# Altium schematic sheet CPU.SchDoc
size A4
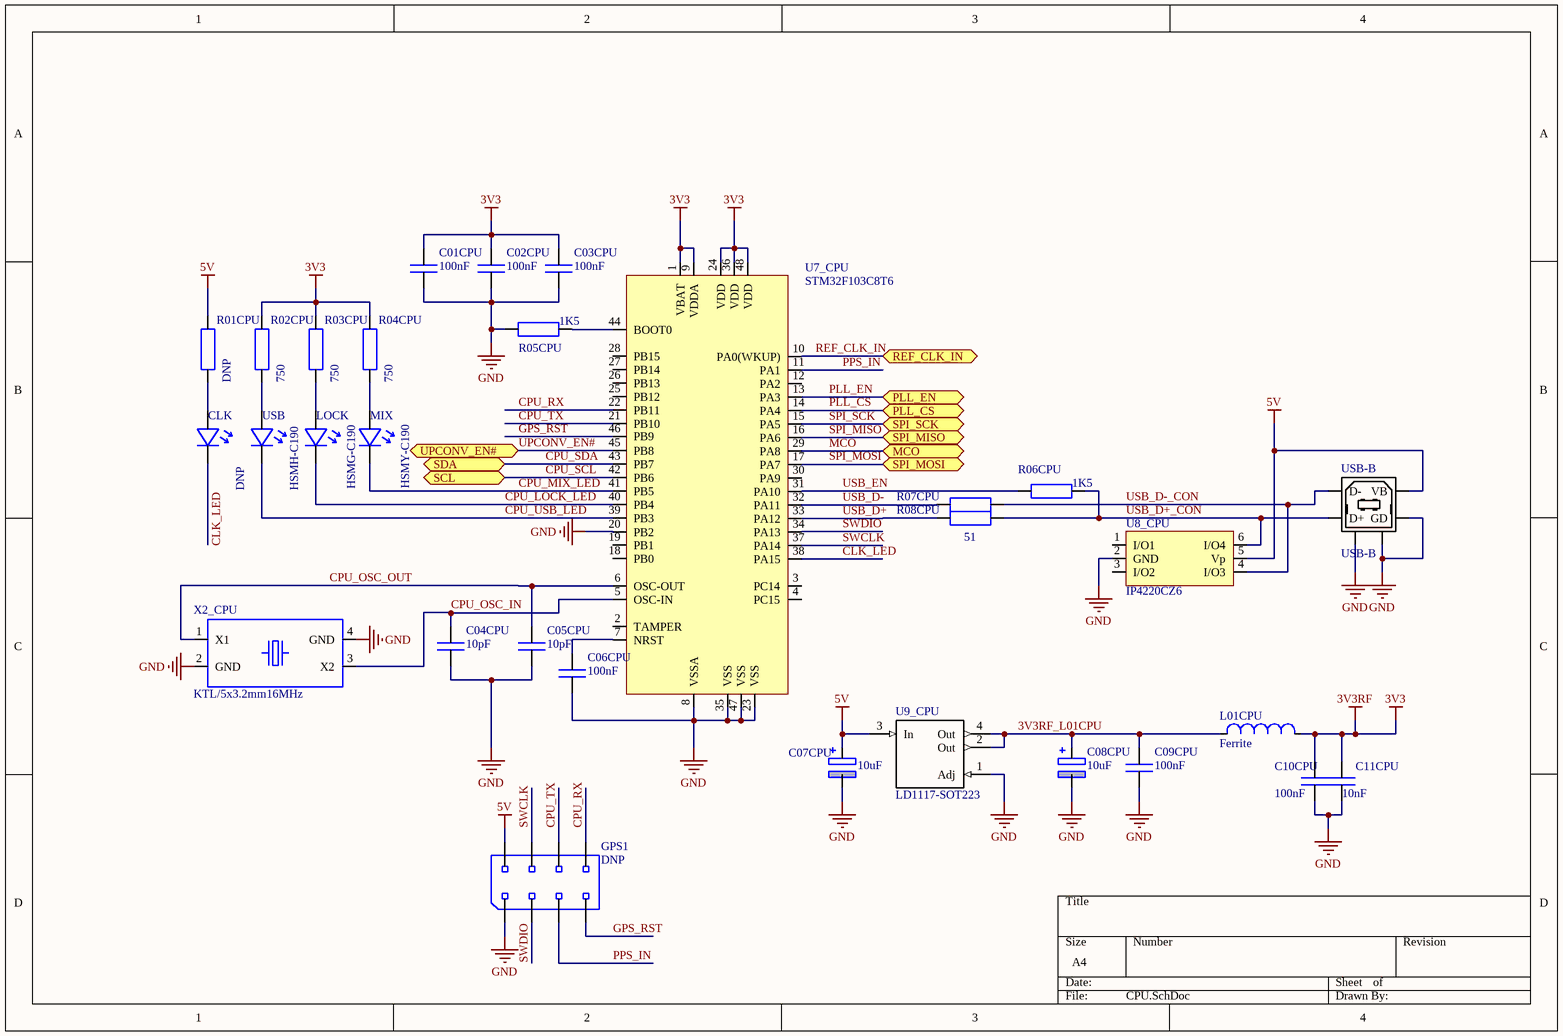
[diagram p0: CPU.SchDoc]

## Parts
C01CPU  100nF  [smd C0603_0.80]
C02CPU  100nF  [smd C0603_0.80]
C03CPU  100nF  [smd C0603_0.80]
C04CPU  10pF  [smd C0603_0.80]
C05CPU  10pF  [smd C0603_0.80]
C06CPU  100nF  [smd C0603_0.80]
C07CPU  10uF  [smd C1206 polar]
C08CPU  10uF  [smd C1206 polar]
C09CPU  100nF  [smd C0603_0.80]
C10CPU  100nF  [smd C0603_0.80]
C11CPU  10nF  [smd C0603_0.80]
CLK  DNP  [led HSMH-C190 (Avago Technologies)]
GPS1  DNP  [hdr 2x4]
L01CPU  Ferrite  [smd C0805]
LOCK  HSMG-C190  [led HSMH-C190 (Avago Technologies)]
MIX  HSMY-C190  [led HSMH-C190 (Avago Technologies)]
R01CPU  DNP  [smd C0603_0.45]
R02CPU  750  [smd C0603_0.45]
R03CPU  750  [smd C0603_0.45]
R04CPU  750  [smd C0603_0.45]
R05CPU  1K5  [smd C0603_0.45]
R06CPU  1K5  [smd C0603_0.45]
R07CPU  51  [smd C0603_0.45]  (value not drawn)
R08CPU  51  [smd C0603_0.45]
U7_CPU  STM32F103C8T6  [TSQFP50P900X900X160-48N]
U8_CPU  IP4220CZ6  [smd SOT-457]
U9_CPU  LD1117-SOT223  [SOT223]
USB  HSMH-C190  [led HSMH-C190 (Avago Technologies)]
USB-B  USB-B  [USB-B]
X2_CPU  KTL/5x3.2mm16MHz  [smd KTL 5x3.2]

## Ports
MCO, PLL_CS, PLL_EN, REF_CLK_IN, SCL, SDA, SPI_MISO, SPI_MOSI, SPI_SCK, UPCONV_EN#

## Nets
3V3: C01CPU.2 C02CPU.2 C03CPU.2 C10CPU.2 C11CPU.2 L01CPU.2 R02CPU.2 R03CPU.2 R04CPU.2 U7_CPU.1(VBAT) U7_CPU.9(VDDA) U7_CPU.24(VDD) U7_CPU.36(VDD) U7_CPU.48(VDD)  [also labelled 3V3RF]
5V: C07CPU.1 GPS1.2 R01CPU.2 U8_CPU.5(Vp) U9_CPU.3(In) USB-B.1(VB)
GND: C01CPU.1 C02CPU.1 C03CPU.1 C04CPU.1 C05CPU.1 C06CPU.1 C07CPU.2 C08CPU.2 C09CPU.1 C10CPU.1 C11CPU.1 GPS1.1 R05CPU.1 U7_CPU.8(VSSA) U7_CPU.20(PB2) U7_CPU.23(VSS) U7_CPU.35(VSS) U7_CPU.47(VSS) U8_CPU.2(GND) U9_CPU.1(Adj) USB-B.4(GD) USB-B.5 USB-B.6 X2_CPU.2(GND) X2_CPU.4(GND)
3V3RF_L01CPU: C08CPU.1 C09CPU.2 L01CPU.1 U9_CPU.2(Out) U9_CPU.4(Out)
CLK_LED: CLK.2 U7_CPU.38(PA15)
CPU_LOCK_LED: LOCK.2 U7_CPU.40(PB4)
CPU_MIX_LED: MIX.2 U7_CPU.41(PB5)
CPU_OSC_IN: C04CPU.2 U7_CPU.5(OSC-IN) X2_CPU.3(X2)
CPU_OSC_OUT: C05CPU.2 U7_CPU.6(OSC-OUT) X2_CPU.1(X1)
CPU_RX: GPS1.8 U7_CPU.22(PB11)
CPU_SCL: U7_CPU.42(PB6) ; port SCL
CPU_SDA: U7_CPU.43(PB7) ; port SDA
CPU_TX: GPS1.6 U7_CPU.21(PB10)
CPU_USB_LED: U7_CPU.39(PB3) USB.2
GPS_RST: GPS1.7 U7_CPU.46(PB9)
MCO: U7_CPU.29(PA8) ; port MCO
PLL_CS: U7_CPU.14(PA4) ; port PLL_CS
PLL_EN: U7_CPU.13(PA3) ; port PLL_EN
PPS_IN: GPS1.5 U7_CPU.11(PA1)
REF_CLK_IN: U7_CPU.10(PA0(WKUP)) ; port REF_CLK_IN
SPI_MISO: U7_CPU.16(PA6) ; port SPI_MISO
SPI_MOSI: U7_CPU.17(PA7) ; port SPI_MOSI
SPI_SCK: U7_CPU.15(PA5) ; port SPI_SCK
SWCLK: GPS1.4 U7_CPU.37(PA14)
SWDIO: GPS1.3 U7_CPU.34(PA13)
UPCONV_EN#: U7_CPU.45(PB8) ; port UPCONV_EN#
USB_D+: R08CPU.1 U7_CPU.33(PA12)
USB_D+_CON: R06CPU.2 R08CPU.2 U8_CPU.6(I/O4) USB-B.3(D+)
USB_D-: R07CPU.1 U7_CPU.32(PA11)
USB_D-_CON: R07CPU.2 U8_CPU.4(I/O3) USB-B.2(D-)
USB_EN: R06CPU.1 U7_CPU.31(PA10)
NetC06CPU_2: C06CPU.2 U7_CPU.7(NRST)
NetCLK_1: CLK.1 R01CPU.1
NetLOCK_1: LOCK.1 R03CPU.1
NetMIX_1: MIX.1 R04CPU.1
NetR02CPU_1: R02CPU.1 USB.1
NetR05CPU_2: R05CPU.2 U7_CPU.44(BOOT0)

Not connected (* = marked no-connect by the designer): U7_CPU 2(TAMPER) 3(PC14) 4(PC15) 12(PA2) 18(PB0) 19(PB1) 25(PB12) 26(PB13) 27(PB14) 28(PB15) 30(PA9); U8_CPU 1(I/O1) 3(I/O2)

## Library data of the parts
C01CPU C02CPU C03CPU C06CPU C09CPU C10CPU C11CPU = CSMD603/100nF: smd capaciteit, verp.0603, 100nF; Part Number: CSMD603/100nF; Component Kind: Standard; Component Type: Standard; Designator: CSMD603/100nF; Pin Count: 2; Supplier 1: Farnell
C04CPU C05CPU = CSMD603/10pF: smd capaciteit, verp.0603, 10pF; Part Number: CSMD603/10pF; Component Kind: Standard; Component Type: Standard; Designator: CSMD603/10pF; Pin Count: 2; Supplier 1: Farnell
C07CPU C08CPU = CSMD1206/10uF/10V: smd capaciteit, tantalium, verp.1206, 10uF/10V; Part Number: CSMD1206/10uF/10V; Component Kind: Standard; Component Type: Standard; Designator: CSMD1206/10uF/10V; Pin Count: 2; Supplier 1: Farnell
CLK USB = HSMH-C190: led smd rood, Avago Techn., HSMH-C190; Supplier 1: Farnell
GPS1 = CON HDR 2x4: pcb header recht 2x4  pitch 100mil; Part Number: CON HDR 2x4; Component Kind: Standard; Component Type: Standard; Designator: CON HDR 2x4; Pin Count: 8; Supplier 1: Farnell
L01CPU = Ferrite 0805: Ferrite bead, 0805 package; Supplier 1: Farnell
LOCK = HSMG-C190: led smd groen, Avago Techn., HSMG-C190; Supplier 1: Farnell
MIX = HSMY-C190: led smd geel, Avago Techn., HSMY-C190; Supplier 1: Farnell
R01CPU R02CPU R03CPU R04CPU = 470R/603: weerstand SMD603, 470R; Supplier 1: Farnell
R05CPU R06CPU = 1K5/603: weerstand SMD603, 1K5; Supplier 1: Farnell
R07CPU R08CPU = 22R/603: weerstand SMD603, 22R; Supplier 1: Farnell
U7_CPU = STM32F100xx
U8_CPU = IP4220CZ6: Dual USB 2.0 integrated ESD protection; Supplier 1: Farnell
USB-B = USB-B: USB B DEVICE CONNECTOR; Text Field1: Assmann; Text Field2: AU-Y1007; Text Field3: Digi-Key; Text Field4: AE1085-ND; Text Field5: Thru-Hole; Text Field6: 1.168; NI?: *; O?: *; Section:: *
X2_CPU = KTL/5x3.2mm 16MHz: TXC Xtal 16.000 MHz, 5x3.2mm; Part Number: KTL/5x3.2mm 16MHz; Component Kind: Standard; Component Type: Standard; Designator: KTL/5x3.2mm 16MHz; Pin Count: 4; Supplier 1: Farnell